# Altium schematic sheet AFR_Template_Overview.SchDoc
size A4; Author: Auth. Name; CompanyName: Audi Formula Racing GmbH; Organization: Audi Formula Racing GmbH; Address1: Heinrichsheimstr. 200; Address2: D-86633 Neuburg a.d. Donau; SheetNumber: 2; SheetTotal: 2
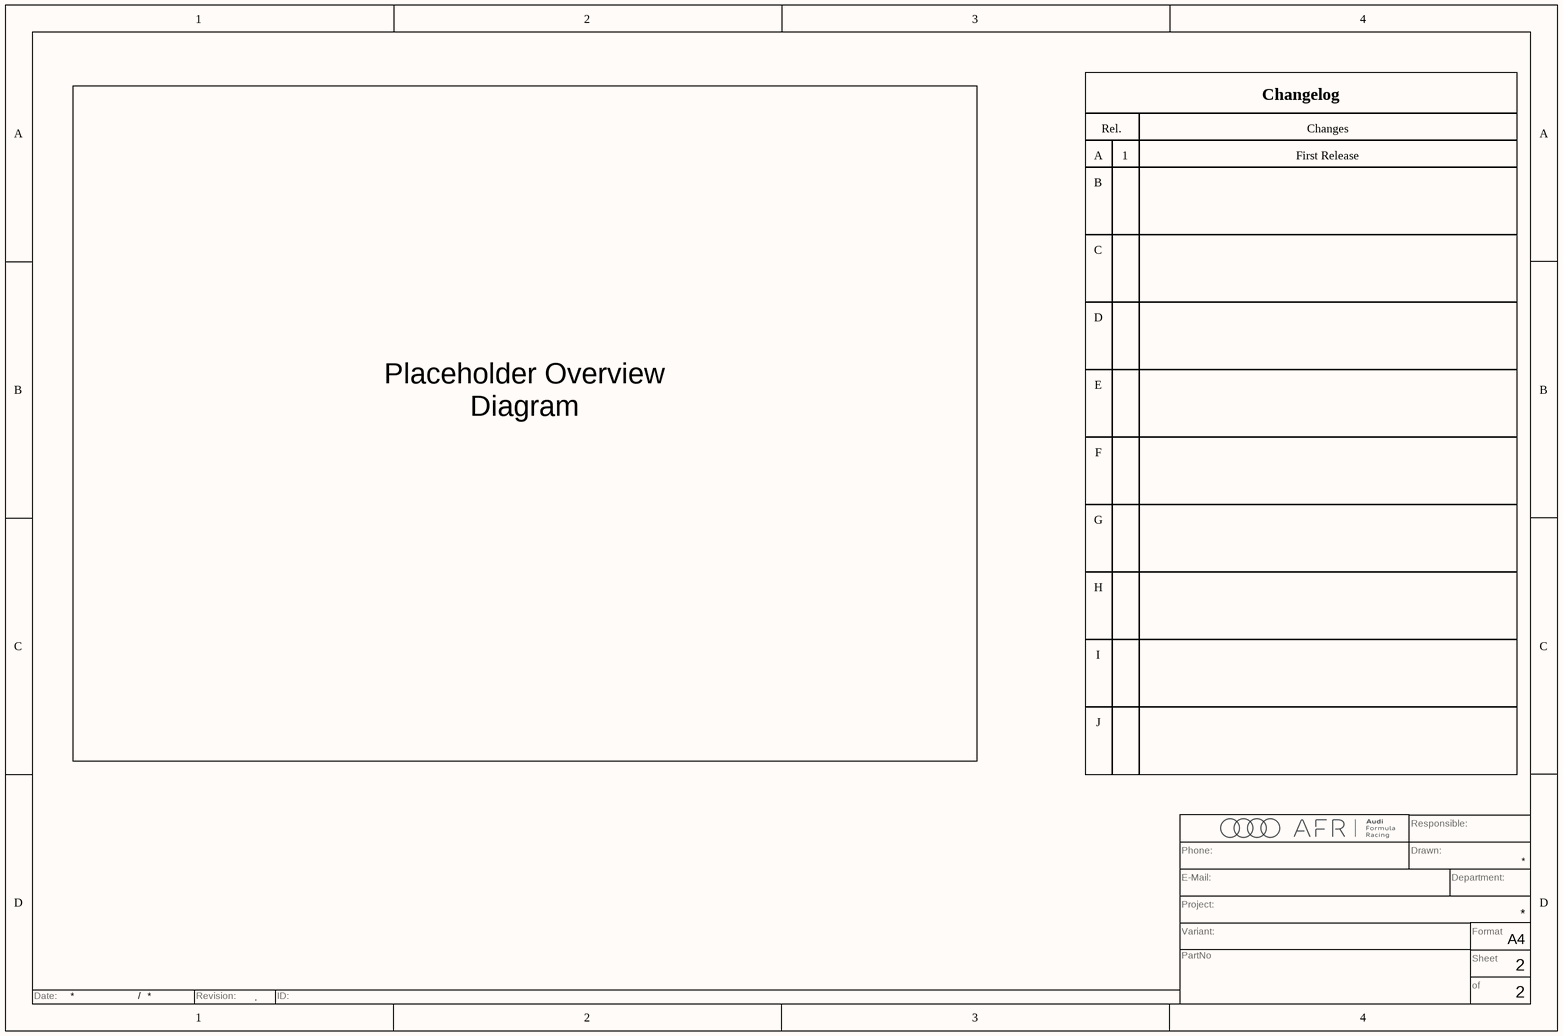
[diagram p0: AFR_Template_Overview.SchDoc]

## Notes on the sheet
- Changelog
- Rel.
- A
- 1
- Changes
- First Release
- B
- C
- D
- E
- F
- G
- H
- I
- Placeholder Overview Diagram
- J
- Phone:
- Responsible:
- Drawn:
- Variant:
- Project:
- E-Mail:
- Department:
- Format
- PartNo
- of
- Sheet
- A4
- Date:
- /
- Revision:
- .
- ID: